# EAGLE schematic PiZeroHifi (EAGLE 9.6.2)
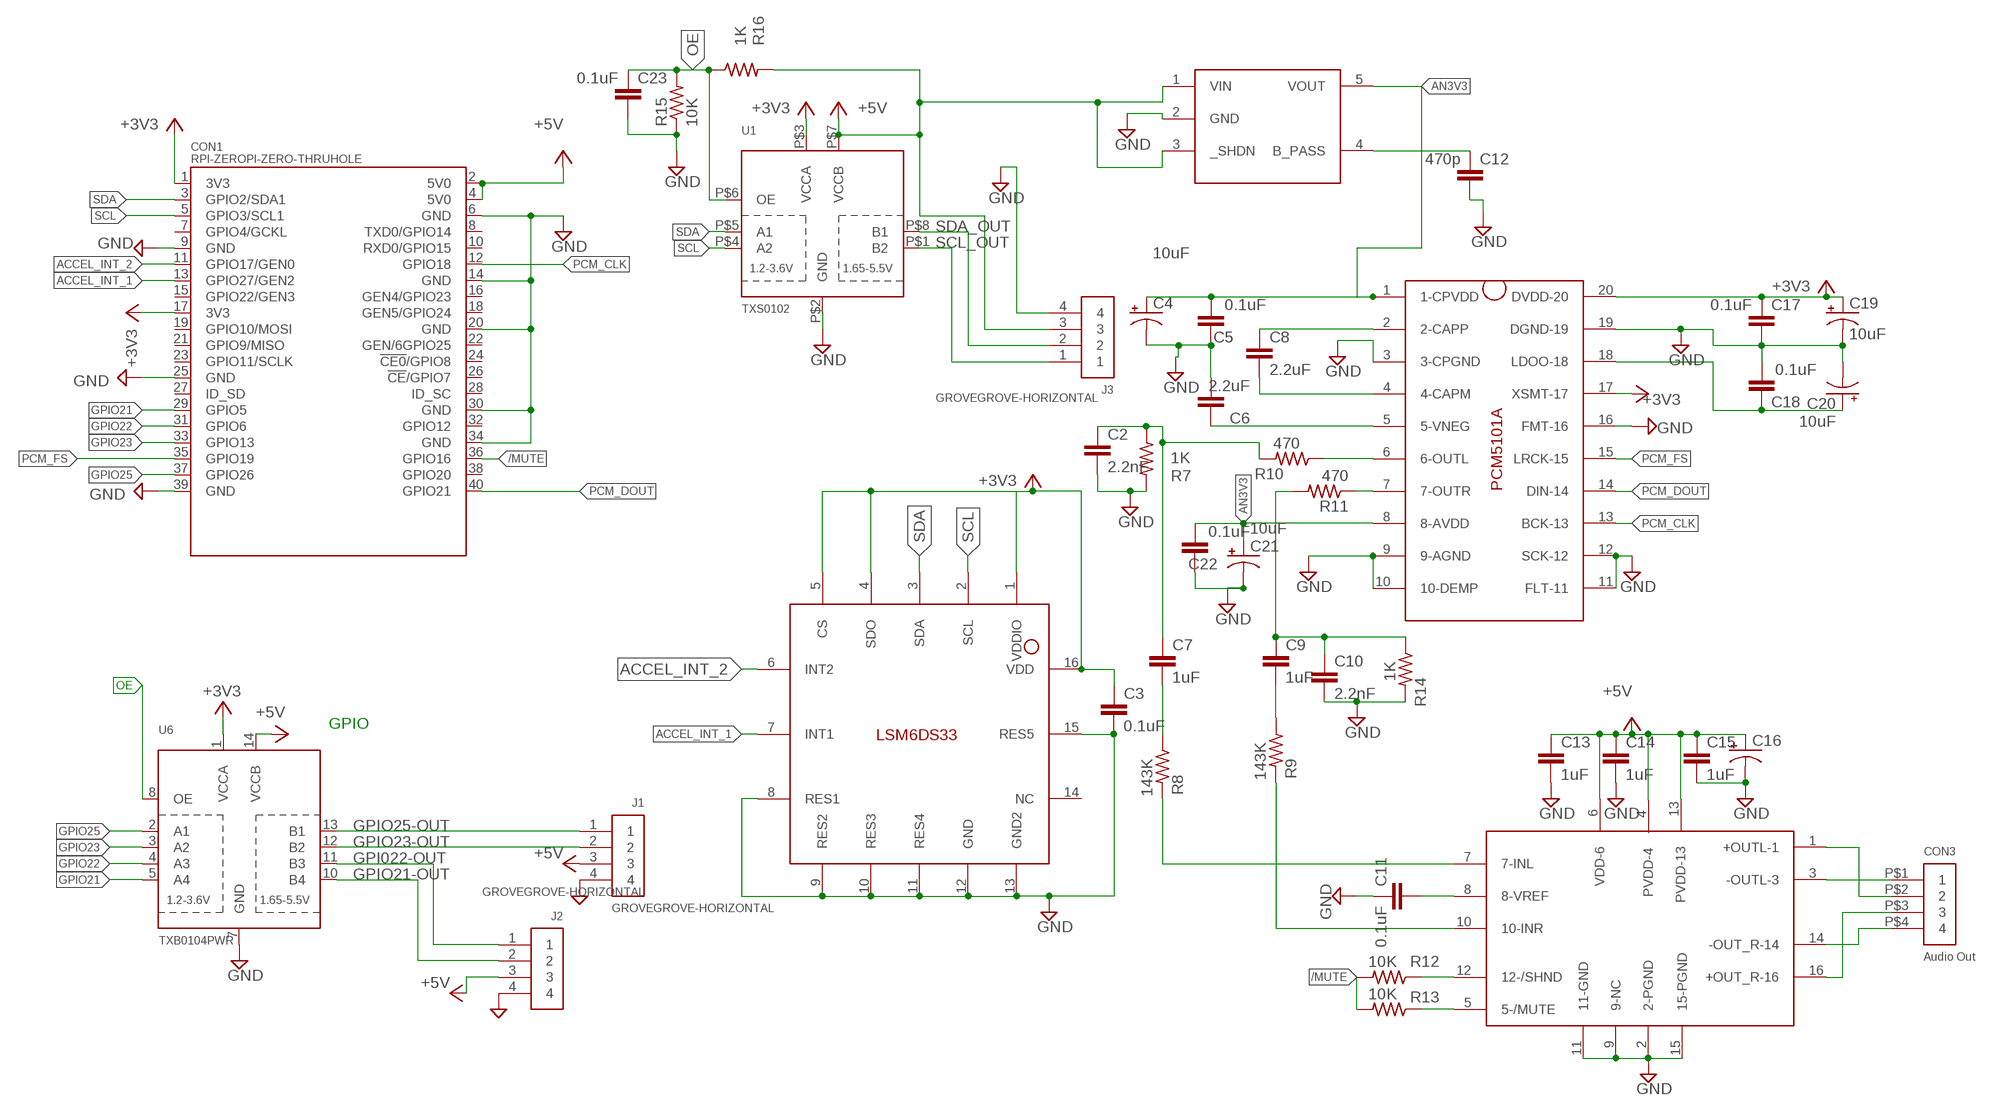
[diagram p0: schematic, sheet 1]

## Parts
C2  2.2nF  C-EUC0603  [C0603]
C3  0.1uF  C-EUC0603  [C0603]
C4  10uF  CAP-POLARISED1206-POLAR  [EIA3216]
C5  0.1uF  C-EUC0603  [C0603]
C6  2.2uF  C-EUC0603  [C0603]
C7  1uF  C-EUC0603  [C0603]
C8  2.2uF  C-EUC0603  [C0603]
C9  1uF  C-EUC0603  [C0603]
C10  2.2nF  C-EUC0603  [C0603]
C11  0.1uF  C-EUC0603  [C0603]
C12  470p  C-EUC0603  [C0603]
C13  1uF  C-EUC0603  [C0603]
C14  1uF  C-EUC0603  [C0603]
C15  1uF  C-EUC0603  [C0603]
C16  1500uF  WURTH-CAP  [CAP8MMX3.5MMX20MM]
C17  0.1uF  C-EUC0603  [C0603]
C18  0.1uF  C-EUC0603  [C0603]
C19  10uF  CAP-POLARISED1206-POLAR  [EIA3216]
C20  10uF  CAP-POLARISED1206-POLAR  [EIA3216]
C21  10uF  CAP-POLARISED1206-POLAR  [EIA3216]
C22  0.1uF  C-EUC0603  [C0603]
C23  0.1uF  C-EUC0603  [C0603]
CON1  RPI-ZEROPI-ZERO-THRUHOLE  [RASPBERRYPI_ZERO_THRUHOLE]
CON3  Audio Out  SCREW-TERM-4X5.08MM  [TERM-4P-SIDE-5.08MM]
J1  GROVEGROVE-HORIZONTAL  [JST-4-PTH]
J2  GROVEGROVE-HORIZONTAL  [JST-4-PTH]
J3  GROVEGROVE-HORIZONTAL  [JST-4-PTH]
R7  1K  R-US_R0603  [R0603]
R8  143K  R-US_R0603  [R0603]
R9  143K  R-US_R0603  [R0603]
R10  470  R-US_R0603  [R0603]
R11  470  R-US_R0603  [R0603]
R12  10K  R-US_R0603  [R0603]
R13  10K  R-US_R0603  [R0603]
R14  1K  R-US_R0603  [R0603]
R15  10K  R-US_R0603  [R0603]
R16  1K  R-US_R0603  [R0603]
U1  TXS0102  [VFSOP-8]
U2  LSM6DS33  LSM6DS33LGA-16-3X3  [LGA-16-3X3]
U3  TC1014-3.3V  [GHI-IC_SOT23-5(MICROCHIP)]
U4  PCM5101A  [TSSOP20-0.65-6.5X4.4MM]
U5  PAM8403  [SOP-16]
U6  TXB0104PWR  [TSSOP14]

## Nets
+3V3: C3.1 C17.2 C19.+ CON1.1(3V3) CON1.17(3V3) U1.P$3(VCCA) U2.1(VDDIO) U2.4(SDO) U2.5(CS) U2.16(VDD) U4.17(XSMT-17) U4.20(DVDD-20) U6.1(VCCA)
+5V: C13.1 C14.1 C15.1 C16.P$1(+) CON1.2(5V0) CON1.4(5V0) J1.3 J2.3 J3.3 R16.2 U1.P$7(VCCB) U3.1(VIN) U3.3(_SHDN) U5.4(PVDD-4) U5.6(VDD-6) U5.13(PVDD-13) U6.14(VCCB)
+L: CON3.P$2 U5.1(+OUTL-1)
+R: CON3.P$3 U5.16(+OUT_R-16)
-L: CON3.P$1 U5.3(-OUTL-3)
-R: CON3.P$4 U5.14(-OUT_R-14)
/MUTE: CON1.36(GPIO16) R12.2 R13.2
ACCEL_INT_1: CON1.13(GPIO27/GEN2) U2.7(INT1)
ACCEL_INT_2: CON1.11(GPIO17/GEN0) U2.6(INT2)
AN3V3: C4.+ C5.2 C21.+ C22.2 U3.5(VOUT) U4.1(1-CPVDD) U4.8(8-AVDD)
GND: C2.2 C3.2 C4.- C5.1 C6.2 C10.2 C11.2 C12.1 C13.2 C14.2 C15.2 C16.P$2(-) C17.1 C18.2 C19.- C20.- C21.- C22.1 C23.1 CON1.6(GND) CON1.9(GND) CON1.14(GND) CON1.20(GND) CON1.25(GND) CON1.30(GND) CON1.34(GND) CON1.39(GND) J1.4 J2.4 J3.4 R7.2 R14.2 R15.1 U1.P$2(GND) U2.8(RES1) U2.9(RES2) U2.10(RES3) U2.11(RES4) U2.12(GND) U2.13(GND2) U2.15(RES5) U3.2(GND) U4.3(3-CPGND) U4.9(9-AGND) U4.10(10-DEMP) U4.11(FLT-11) U4.12(SCK-12) U4.16(FMT-16) U4.19(DGND-19) U5.2(2-PGND) U5.9(9-NC) U5.11(11-GND) U5.15(15-PGND) U6.7(GND)
GPI022-OUT: J2.1 U6.11(B3)
GPIO21: CON1.29(GPIO5) U6.5(A4)
GPIO21-OUT: J2.2 U6.10(B4)
GPIO22: CON1.31(GPIO6) U6.4(A3)
GPIO23: CON1.33(GPIO13) U6.3(A2)
GPIO23-OUT: J1.2 U6.12(B2)
GPIO25: CON1.37(GPIO26) U6.2(A1)
GPIO25-OUT: J1.1 U6.13(B1)
N$1: C8.1 U4.2(2-CAPP)
N$2: C8.2 U4.4(4-CAPM)
N$3: C6.1 U4.5(5-VNEG)
N$4: C18.1 C20.+ U4.18(LDOO-18)
N$5: R10.1 U4.6(6-OUTL)
N$6: R11.1 U4.7(7-OUTR)
N$7: C7.2 R8.1
N$8: C9.1 C10.1 R11.2 R14.1
N$9: C2.1 C7.1 R7.1 R10.2
N$10: C9.2 R9.1
N$11: R8.2 U5.7(7-INL)
N$12: R9.2 U5.10(10-INR)
N$13: C12.2 U3.4(B_PASS)
N$18: C11.1 U5.8(8-VREF)
N$19: R12.1 U5.12(12-/SHND)
N$20: R13.1 U5.5(5-/MUTE)
OE: C23.2 R15.2 R16.1 U1.P$6(OE) U6.8(OE)
PCM_CLK: CON1.12(GPIO18) U4.13(BCK-13)
PCM_DOUT: CON1.40(GPIO21) U4.14(DIN-14)
PCM_FS: CON1.35(GPIO19) U4.15(LRCK-15)
SCL: CON1.5(GPIO3/SCL1) U1.P$4(A2) U2.2(SCL)
SCL_OUT: J3.1 U1.P$1(B2)
SDA: CON1.3(GPIO2/SDA1) U1.P$5(A1) U2.3(SDA)
SDA_OUT: J3.2 U1.P$8(B1)
Unconnected: CON1.7(GPIO4/GCKL) CON1.8(TXD0/GPIO14) CON1.10(RXD0/GPIO15) CON1.15(GPIO22/GEN3) CON1.16(GEN4/GPIO23) CON1.18(GEN5/GPIO24) CON1.19(GPIO10/MOSI) CON1.21(GPIO9/MISO) CON1.22(GEN/6GPIO25) CON1.23(GPIO11/SCLK) CON1.24(!CE0!/GPIO8) CON1.26(!CE!/GPIO7) CON1.27(ID_SD) CON1.28(ID_SC) CON1.32(GPIO12) CON1.38(GPIO20) U2.14(NC)

## Notes on the sheet
- GPIO

## Library data of the parts
C2 C10 = rcl:C-EU: CAPACITOR, European symbol; MF: YAGEO; MPN: CC0603KRX7R9BB222; OC_FARNELL: 722194; SPICEPREFIX: C
C3 C5 C11 C17 C18 C22 C23 = rcl:C-EU: CAPACITOR, European symbol; MF: YAGEO; MPN: CC0603KRX7R7BB104; OC_FARNELL: 432210; SPICEPREFIX: C
C4 C19-C21 = HappyBrackets:CAP-POLARISED: Polarised capacitor; MF: AVX; MPN: 08053D106KAT2A; OC_FARNELL: 1867958
C6 C8 = rcl:C-EU: CAPACITOR, European symbol; OC_FARNELL: unknown; SPICEPREFIX: C
C7 C9 C13-C15 = rcl:C-EU: CAPACITOR, European symbol; MF: AVX; MPN: 06033C104JAT2A; OC_FARNELL: 1740614; SPICEPREFIX: C
C12 = rcl:C-EU: CAPACITOR, European symbol; MF: AVX; MPN: 06035C471KAT2A; OC_FARNELL: 498580; SPICEPREFIX: C
C16 = HappyBrackets:WURTH-CAP: WURTH Electrolytic cap laid on side; OC_FARNELL: unknown
CON1 = HappyBrackets:RPI-ZERO: Adafruit GPIO Header for Raspberry Pi HAT - 2x20 Short Female Header; OC_FARNELL: unknown
CON3 = HappyBrackets:SCREW-TERM-4X5.08MM: 4 screw terminal block 5.08mm pin spacing; OC_FARNELL: unknown
J1-J3 = HappyBrackets:GROVE; OC_FARNELL: unknown
R7 R14 R16 = adafruit:R-US_: RESISTOR, American symbol; MF: MULTICOMP PRO; MPN: MCWR06X1001FTL; OC_FARNELL: 2447272RL
R8 R9 = adafruit:R-US_: RESISTOR, American symbol; MF: PANASONIC; MPN: ERJ3EKF1433V; OC_FARNELL: 2303238
R10 R11 = adafruit:R-US_: RESISTOR, American symbol; MF: VISHAY; MPN: CRCW0603470RFKEA; OC_FARNELL: 1469815
R12 R13 R15 = adafruit:R-US_: RESISTOR, American symbol; MF: YAGEO; MPN: RC0603FR-0710KL; OC_FARNELL: 9238603
U1 = adafruit:TXS0102: 2-Bit Bi-Directional Level Shifter (I2C, etc.) Designed for I2C devices and has internal pullups. Not to be confused with TXB010x series. 1.2V-3.6V (VCCA) to 1.65V-5.5V (VCCB) bi-directional level shifter with auto direction sensing. Max data rate - 24Mbps (Push Pull), 2Mbps (Open Drain) Digikey: 296-21931-1-ND; OC_FARNELL: unknown
U2 = HappyBrackets:LSM6DS33: iNEMO inertial module: always-on 3D accelerometer and 3D gyroscope; DIGIKEY: 497-15996-1-ND; OC_FARNELL: unknown
U3 = HappyBrackets:TC1014-3.3V; MF: MICROCHIP; MPN: TC1014-3.3VCT713; OC_FARNELL: 1331502
U4 = HappyBrackets:PCM5101A: PCM510xA 2.1VRMS, 112/106/100dB AudioStereoDAC with PLL and 32-bit, 384 kHz PCM Interface; DIGIKEY: 296-36706-1-ND; OC_FARNELL: unknown
U5 = HappyBrackets:PAM8403: PAM8403 The PAM8403 is a 3W, class-D audio amplifier. It offers low THD+N, allowing it to achieve high-quality sound reproduction. The new filterless architecture allows the device to drive the speaker directly, requiring no low-pass output filters, thus saving system cost and PCB area. With the same numbers of external components, the efficiency of the PAM8403 is much better than that of Class-AB cousins. It can extend the battery life, which makes it well-suited for portable applications. The PAM8403 is available in SOP-16 package.; DIGIKEY: PAM8403DRDICT-ND; MF: DIODES INC.; MPN: PAM8403DR; OC_FARNELL: 3373823
U6 = adafruit:TXB0104PWR: 4-Bit Bi-Directional Level Shifter 1.2V-3.6V (VCCA) to 1.65V-5.5V (VCCB) bi-directional level shifter with auto direction sensing. Max data rate - VCCA 1.8V: 20Mbps (50ns), VCCA 3.3V: 100Mbps (10ns) Digikey: 296-21929-1-ND; MF: TEXAS INSTRUMENTS; MPN: TXB0104PWR .; OC_FARNELL: 1607891

## Net classes
0 default: width 0.152 mm, clearance 0.152 mm